# Altium schematic sheet Sheet4.SchDoc
size A4
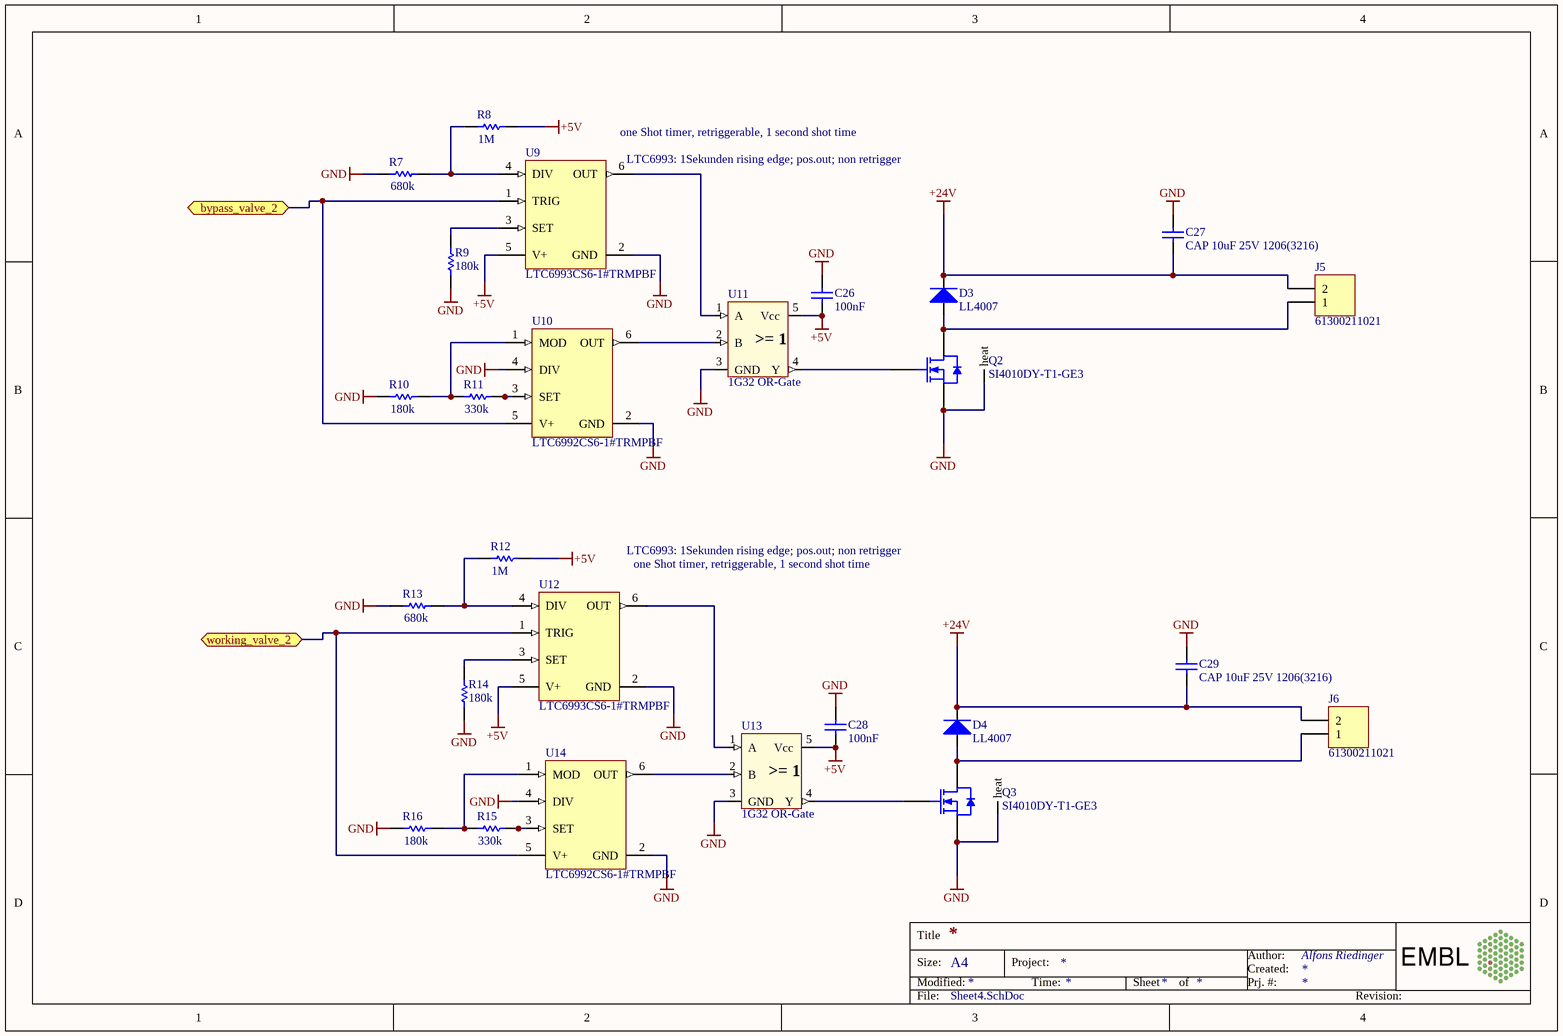
[diagram p0: Sheet4.SchDoc]

## Parts
C26  100nF  [CAPC2013X88X50ML20T25]
C27  CAP 10uF 25V 1206(3216)  [CAPC1206(3216)190_N]
C28  100nF  [CAPC2013X88X50ML20T25]
C29  CAP 10uF 25V 1206(3216)  [CAPC1206(3216)190_N]
D3  LL4007  [LL4007]
D4  LL4007  [LL4007]
J5  61300211021  [61300211021]
J6  61300211021  [61300211021]
Q2  SI4010DY-T1-GE3  [PCBComponent]
Q3  SI4010DY-T1-GE3  [PCBComponent]
R7  680k  [YAGO-RC0805_M]
R8  1M  [YAGO-RC0805_M]
R9  180k  [YAGO-RC0805_M]
R10  180k  [YAGO-RC0805_M]
R11  330k  [YAGO-RC0805_M]
R12  1M  [YAGO-RC0805_M]
R13  680k  [YAGO-RC0805_M]
R14  180k  [YAGO-RC0805_M]
R15  330k  [YAGO-RC0805_M]
R16  180k  [YAGO-RC0805_M]
U9  LTC6993CS6-1#TRMPBF  [LT-S6-6-TSOT-23_L]
U10  LTC6992CS6-1#TRMPBF  [LT-S6-6-TSOT-23_N]
U11  1G32 OR-Gate  [SOT23-5 medium density]
U12  LTC6993CS6-1#TRMPBF  [LT-S6-6-TSOT-23_L]
U13  1G32 OR-Gate  [SOT23-5 medium density]
U14  LTC6992CS6-1#TRMPBF  [LT-S6-6-TSOT-23_N]

## Ports
bypass_valve_2 (bidir), working_valve_2 (bidir)

## Nets
+5V: C26.2 C28.2 R8.2 R12.2 U9.5(V+) U11.5(Vcc) U12.5(V+) U13.5(Vcc)
+24V: C27.1 C29.1 D3.2(K) D4.2(K) J5.2 J6.2
GND: C26.1 C27.2 C28.1 C29.2 Q2.1(S) Q2.2(S) Q2.3(S) Q2.9(heat) Q3.1(S) Q3.2(S) Q3.3(S) Q3.9(heat) R7.1 R9.1 R10.1 R13.1 R14.1 R16.1 U9.2(GND) U10.2(GND) U10.4(DIV) U11.3(GND) U12.2(GND) U13.3(GND) U14.2(GND) U14.4(DIV)
bypass_valve_2: U9.1(TRIG) U10.5(V+) ; port bypass_valve_2
working_valve_2: U12.1(TRIG) U14.5(V+) ; port working_valve_2
NetD3_1: D3.1(A) J5.1 Q2.5(D) Q2.6(D) Q2.7(D) Q2.8(D)
NetD4_1: D4.1(A) J6.1 Q3.5(D) Q3.6(D) Q3.7(D) Q3.8(D)
NetQ2_4: Q2.4(G) U11.4(Y)
NetQ3_4: Q3.4(G) U13.4(Y)
NetR7_2: R7.2 R8.1 U9.4(DIV)
NetR9_2: R9.2 U9.3(SET)
NetR10_2: R10.2 R11.1 U10.1(MOD)
NetR11_2: R11.2 U10.3(SET)
NetR12_1: R12.1 R13.2 U12.4(DIV)
NetR14_2: R14.2 U12.3(SET)
NetR15_1: R15.1 R16.2 U14.1(MOD)
NetR15_2: R15.2 U14.3(SET)
NetU9_6: U9.6(OUT) U11.1(A)
NetU10_6: U10.6(OUT) U11.2(B)
NetU12_6: U12.6(OUT) U13.1(A)
NetU13_2: U13.2(B) U14.6(OUT)

## Notes on the sheet
- (near U9) one Shot timer, retriggerable, 1 second shot time
- (near U9) LTC6993: 1Sekunden rising edge; pos.out; non retrigger
- (near U12) LTC6993: 1Sekunden rising edge; pos.out; non retrigger
- (near U12) one Shot timer, retriggerable, 1 second shot time
- Title
- Size:
- Modified:
- A4
- Project:
- Time:
- Sheet
- of
- Created:
- Author:
- Prj. #:
- Alfons Riedinger
- File:
- Revision:
- (in symbol CMP-001-0059-1) >= 1

## Library data of the parts
C26 C28 = CMP-001-0082-2: generic 0805 COG oder X7R Vielschichtkondensatoren max. +/-10%
C27 C29 = CMP-00471-2: CAP 10uF 25V -20% to +80% 1206 (3216 Metric) Thickness 1.9mm SMD; Manufacturer: Wurth Electronics Inc.; Manufacturer Part Number: 885012208069; PartNumber: 885 012 208 069; Case-EIA: 1206; Case-Metric: 3216; Temperature Coefficient: X7R; Value: 10uF; Tolerance: -20% to +80%; Max Thickness: 1.9 mm; Rated Voltage: 25 V; Technology: SMT; ComponentLink1Description: 885012208069.pdf; ComponentLink1URL: http://katalog.we-online.de/pbs/datasheet/885012208069.pdf; Mounting Type: Surface Mount, MLCC; Operating Temperature: -55°C ~ 125°C; Package / Case: 1206 (3216 Metric); Packaging: Tape & Reel (TR); Part Status: Active; Size / Dimension: 0.126" L x 0.063" W (3.20mm x 1.60mm); Supplier: Digi-Key; Supplier Part Number: 732-7574-2-ND; Thickness (Max): 0.075" (1.90mm)
D3 D4 = CMP-001-0049-2: LL4007;  Vf 1,1V @ 1A, If = 1A; Manufacturer: TAIWAN SEMICONDUCTOR; PartNumber: LL4007G L2; Bauform - Diode: DO-213; Betriebstemperatur, max.: 175; Diodenkonfiguration: Einfach; Durchlassspannung Vf max.: 1.1; Durchlassstrom (mittlerer) If(AV): 1; Spitzendurchlassstrom Ifsm, max.: 25; SVHC: No SVHC (20-Jun-2016; Verpackung: Gurtabschnitt; Anzahl der Pins: -; ComponentLink1Description: 2182652.pdf; ComponentLink1URL: http://www.farnell.com/datasheets/2182652.pdf; Periodische Sperrspannung Vrrm, max.: 1; Produktpalette: -; Sperrerholzeit Trr, max.: -; Supplier: Farnell; Supplier Part Number: 2677381
J5 J6 = CMP-001-0075-2: 2pol; WR-PHD 2.54 mm THT Angled Pin Header; Brand: Wurth Electronics; Current Rating: 3 A; Insulation Resistance: 1 GOhms; Mating Post Length: 6 mm; Mounting Angle: Right Angle; Number of Positions: 2 Position; Pitch: 2.54 mm; Voltage Rating: 250 V; ComponentLink1Description: 6130xx11021-538004.pdf; ComponentLink1URL: http://www.mouser.com/ds/2/445/6130xx11021-538004.pdf; Contact Gender: Pin (Male); Contact Material: Copper Alloy; Contact Plating: Gold; Contact Type: -; Flammability Rating: UL 94 V-0; Housing Gender: -; Housing Material: Polyamide (PA); Manufacturer: Wurth Electronics; Manufacturer Part Number: 61300211021; Minimum Order Quantity: 1; Mounting Style: Straight Pin; Number of Rows: 1 Row; Packaging: Bulk; Product: Headers; Reeling: False; RoHS - Mouser: Y; Row Spacing: -; Series: WR-PHD; Standard Pack Qty: 1000; Supplier: Mouser; Supplier Part Number: 710-61300211021; Termination Post Length: 3 mm; Termination Style: Through Hole; Type: Pin Strip; PartNumber: 61300211021
Q2 Q3 = CMP-001-0052-1: N-Channel_Mosfet_30V_si4010dy; Vishay - SI4010DY-T1-GE3; 40V; Rds: 0,0034Ohm @ 10V; SOIC-8; Brand: Vishay Semiconductors; ComponentLink1Description: si4010dy-533292.pdf; ComponentLink1URL: http://www.mouser.com/ds/2/427/si4010dy-533292.pdf; Manufacturer: Vishay; Manufacturer Part Number: SI4010DY-T1-GE3; Minimum Order Quantity: 1; Packaging: Reel; Reeling: True; RoHS - Mouser: Y; Series: SI4; Standard Pack Qty: 2500; Supplier: Mouser; Supplier Part Number: 78-SI4010DY-T1-GE3; Technology: Si; Tradename: TrenchFET; PartNumber: SI4010DY-T1-GE3
R7-R16 = CMP-001-0027-2: 0805 Yageo Standard BlackBox Resistors; Power (Watts): 0.125W, 1/8W; Temperature Coefficient: ±200ppm/°C; Tolerance: ±1%; ComponentLink1Description: PYu-RC_Group_51_RoHS_L_7.pdf; Part Status: Active; Size / Dimension: 0.079" L x 0.049" W (2.00mm x 1.25mm); Supplier Device Package: 0805; ComponentLink1URL: http://www.yageo.com/documents/recent/PYu-RC_Group_51_RoHS_L_7.pdf; Composition: Thick Film; Failure Rate: -; Features: Moisture Resistant; Height - Seated (Max): 0.024" (0.60mm); Manufacturer: Yageo; Operating Temperature: -55°C ~ 155°C; Package / Case: 0805 (2012 Metric); Packaging: Digi-Reel®
U9 U12 = CMP-00464-1: TimerBlox: Monostable Pulse Generator (One Shot), 2.25 to 5.5 V, 0 to 70 degC, 6-Pin TSOT-23 (S6), RoHS, Tape and Reel; Manufacturer: Linear Technology; VSET: 0.97 to 1.03 V; RSET: 800 KOhm Max.; tWIDTH: 5 ns Typ.; Mounting Technology: Surface Mount; ComponentLink2Description: Datasheet; PackageDescription: 6-Pin Small Out-Line Transistor, Body 2.9 x 1.625 mm, Pitch 0.95 mm; ComponentLink1Description: Manufacturer URL; ComponentLink3URL: http://cds.linear.com/docs/en/packaging/SOT_6_05-08-1636.pdf; PackageVersion: Jun-10; ComponentLink1URL: http://www.linear.com/; DatasheetVersion: Rev. B; ComponentLink3Description: Package Specification; V+: 2.25 to 5.5 V; ComponentLink2URL: http://cds.linear.com/docs/en/datasheet/69931234fb.pdf; RoHS: TRUE; Temperature Range: 0 to 70 degC; PartNumber: LTC6993CS6-1#TRMPBF; Packing: Tape and Reel
U10 U14 = CMP-001-0026-A.1: IC OSC SILICON PROG TSOT23-6; Manufacturer: Linear Technology; Voltage - Supply: 2.25 V ~ 5.5 V; Frequency: 3.81Hz ~ 1MHz; Part Status: Active; Supplier: Digi-Key; Supplier Device Package: TSOT-23-6; Supplier Part Number: LTC6992CS6-1#TRMPBFCT-ND; Type: Oscillator, Silicon; ComponentLink1Description: 29337; ComponentLink1URL: http://www.linear.com/docs/29337; Count: -; Mounting Type: Surface Mount; Operating Temperature: 0°C ~ 70°C; Package / Case: SOT-23-6 Thin, TSOT-23-6; Packaging: Cut Tape (CT); Manufacturer Part Number: LTC6992CS6-1#TRMPBF; PartNumber: LTC6992CS6-1#TRMPBF
U11 U13 = CMP-001-0059-1: 1G32 OR Gate; SN74AHC1G32DBVR; 2-Input positive OR Gate; Manufacturer Part Number: SN74AHC1G32DBVT; Brand: Texas Instruments; High Level Output Current: - 8 mA; Logic Family: 74AHC; Logic Type: True; Low Level Output Current: 8 mA; Number of Gates: 1 Gate; Number of Input Lines: 2 Input; Number of Output Lines: 1 Output; Operating Supply Voltage: 2.5 V, 3.3 V, 5 V; Propagation Delay Time: 11.4 ns; Supply Voltage - Max: 5.5 V; Supply Voltage - Min: 2 V; Function: OR; Height: 1.15 mm; Length: 2.9 mm; Logic Function: OR; Manufacturer: Texas Instruments; Maximum Operating Temperature: + 125 C; Minimum Operating Temperature: - 40 C; Minimum Order Quantity: 1; Mounting Style: SMD/SMT; Operating Temperature Range: - 40 C to + 125 C; Package/Case: SOT-23-5; Packaging: Reel; Product: Single-Function Gate; Reeling: True; RoHS - Mouser: Y; Series: SN74AHC1G32; Standard Pack Qty: 250; Supplier: Mouser; Supplier Part Number: 595-SN74AHC1G32DBVT; Width: 1.6 mm; PartNumber: SN74AHC1G32DBVR